# Altium schematic sheet LED8_15.SchDoc
size A4
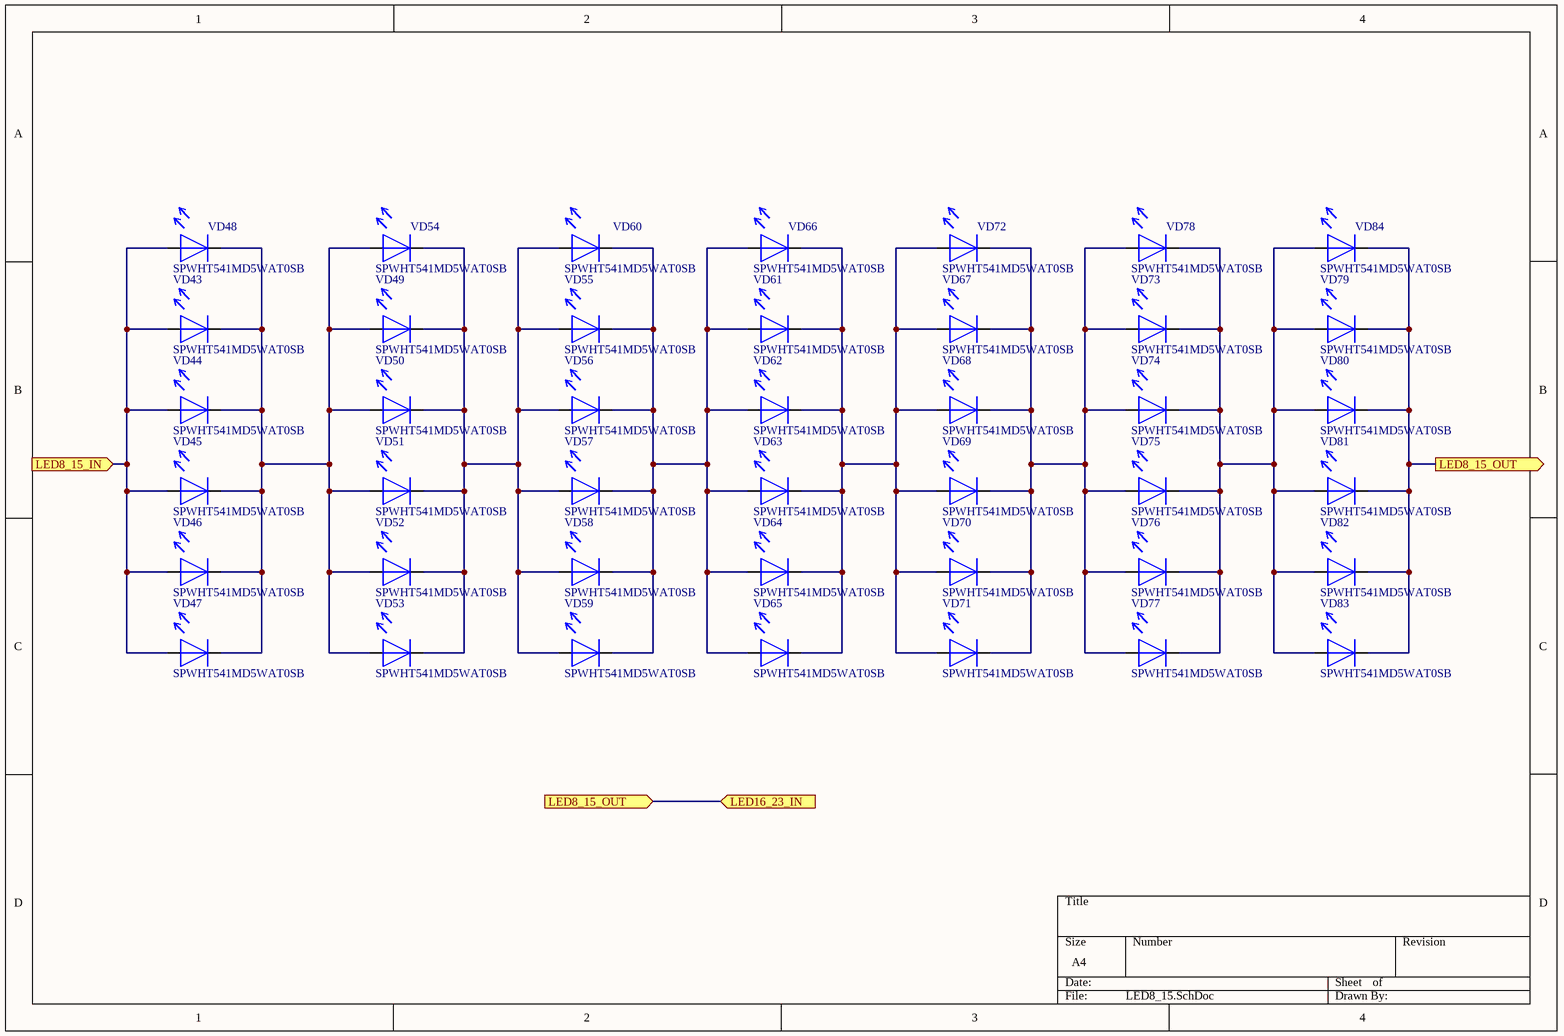
[diagram p0: LED8_15.SchDoc]

## Parts
VD43  SPWHT541MD5WAT0SB  [LED_SAMSUNG]
VD44  SPWHT541MD5WAT0SB  [LED_SAMSUNG]
VD45  SPWHT541MD5WAT0SB  [LED_SAMSUNG]
VD46  SPWHT541MD5WAT0SB  [LED_SAMSUNG]
VD47  SPWHT541MD5WAT0SB  [LED_SAMSUNG]
VD48  SPWHT541MD5WAT0SB  [LED_SAMSUNG]
VD49  SPWHT541MD5WAT0SB  [LED_SAMSUNG]
VD50  SPWHT541MD5WAT0SB  [LED_SAMSUNG]
VD51  SPWHT541MD5WAT0SB  [LED_SAMSUNG]
VD52  SPWHT541MD5WAT0SB  [LED_SAMSUNG]
VD53  SPWHT541MD5WAT0SB  [LED_SAMSUNG]
VD54  SPWHT541MD5WAT0SB  [LED_SAMSUNG]
VD55  SPWHT541MD5WAT0SB  [LED_SAMSUNG]
VD56  SPWHT541MD5WAT0SB  [LED_SAMSUNG]
VD57  SPWHT541MD5WAT0SB  [LED_SAMSUNG]
VD58  SPWHT541MD5WAT0SB  [LED_SAMSUNG]
VD59  SPWHT541MD5WAT0SB  [LED_SAMSUNG]
VD60  SPWHT541MD5WAT0SB  [LED_SAMSUNG]
VD61  SPWHT541MD5WAT0SB  [LED_SAMSUNG]
VD62  SPWHT541MD5WAT0SB  [LED_SAMSUNG]
VD63  SPWHT541MD5WAT0SB  [LED_SAMSUNG]
VD64  SPWHT541MD5WAT0SB  [LED_SAMSUNG]
VD65  SPWHT541MD5WAT0SB  [LED_SAMSUNG]
VD66  SPWHT541MD5WAT0SB  [LED_SAMSUNG]
VD67  SPWHT541MD5WAT0SB  [LED_SAMSUNG]
VD68  SPWHT541MD5WAT0SB  [LED_SAMSUNG]
VD69  SPWHT541MD5WAT0SB  [LED_SAMSUNG]
VD70  SPWHT541MD5WAT0SB  [LED_SAMSUNG]
VD71  SPWHT541MD5WAT0SB  [LED_SAMSUNG]
VD72  SPWHT541MD5WAT0SB  [LED_SAMSUNG]
VD73  SPWHT541MD5WAT0SB  [LED_SAMSUNG]
VD74  SPWHT541MD5WAT0SB  [LED_SAMSUNG]
VD75  SPWHT541MD5WAT0SB  [LED_SAMSUNG]
VD76  SPWHT541MD5WAT0SB  [LED_SAMSUNG]
VD77  SPWHT541MD5WAT0SB  [LED_SAMSUNG]
VD78  SPWHT541MD5WAT0SB  [LED_SAMSUNG]
VD79  SPWHT541MD5WAT0SB  [LED_SAMSUNG]
VD80  SPWHT541MD5WAT0SB  [LED_SAMSUNG]
VD81  SPWHT541MD5WAT0SB  [LED_SAMSUNG]
VD82  SPWHT541MD5WAT0SB  [LED_SAMSUNG]
VD83  SPWHT541MD5WAT0SB  [LED_SAMSUNG]
VD84  SPWHT541MD5WAT0SB  [LED_SAMSUNG]

## Ports
LED8_15_IN (in), LED8_15_OUT (in), LED8_15_OUT (out), LED16_23_IN (in)

## Nets
LED8_15_IN: VD43.1 VD44.1 VD45.1 VD46.1 VD47.1 VD48.1 ; port LED8_15_IN
LED16_23_IN: VD79.2 VD80.2 VD81.2 VD82.2 VD83.2 VD84.2 ; port LED8_15_OUT, port LED16_23_IN
NetVD43_2: VD43.2 VD44.2 VD45.2 VD46.2 VD47.2 VD48.2 VD49.1 VD50.1 VD51.1 VD52.1 VD53.1 VD54.1
NetVD49_2: VD49.2 VD50.2 VD51.2 VD52.2 VD53.2 VD54.2 VD55.1 VD56.1 VD57.1 VD58.1 VD59.1 VD60.1
NetVD55_2: VD55.2 VD56.2 VD57.2 VD58.2 VD59.2 VD60.2 VD61.1 VD62.1 VD63.1 VD64.1 VD65.1 VD66.1
NetVD61_2: VD61.2 VD62.2 VD63.2 VD64.2 VD65.2 VD66.2 VD67.1 VD68.1 VD69.1 VD70.1 VD71.1 VD72.1
NetVD67_2: VD67.2 VD68.2 VD69.2 VD70.2 VD71.2 VD72.2 VD73.1 VD74.1 VD75.1 VD76.1 VD77.1 VD78.1
NetVD73_2: VD73.2 VD74.2 VD75.2 VD76.2 VD77.2 VD78.2 VD79.1 VD80.1 VD81.1 VD82.1 VD83.1 VD84.1

## Library data of the parts
VD43-VD84 = LED SPWHT541MD5WAT0SB: Value: SPWHT541MD5WAT0SB